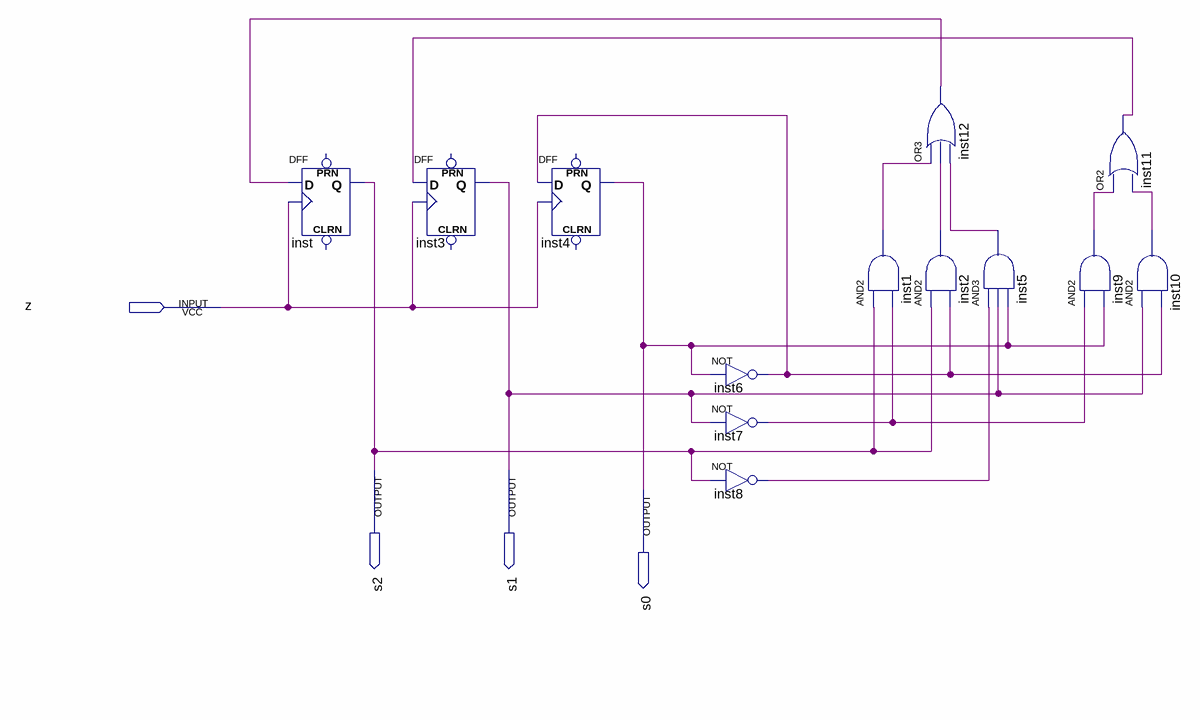
[diagram p0: schematic sheet]
// Quartus schematic Contador.bdf as structural Verilog: 13 symbols, 4 pins
module Contador (
  input  z,
  output s2,
  output s1,
  output s0
);

  wire inst1_out, inst2_out, inst5_out, inst6_out, inst7_out, inst8_out, inst9_out, inst10_out, inst11_out,
       inst12_out;

  DFF inst (.CLK(z), .D(inst12_out), .Q(s2));  // open: CLRN, PRN
  DFF inst3 (.CLK(z), .D(inst11_out), .Q(s1));  // open: CLRN, PRN
  DFF inst4 (.CLK(z), .D(inst6_out), .Q(s0));  // open: CLRN, PRN
  not inst6 (inst6_out, s0);
  not inst7 (inst7_out, s1);
  not inst8 (inst8_out, s2);
  or inst12 (inst12_out, inst1_out, inst2_out, inst5_out);
  and inst1 (inst1_out, s2, inst7_out);
  and inst2 (inst2_out, s2, inst6_out);
  and inst5 (inst5_out, inst8_out, s1, s0);
  and inst9 (inst9_out, inst7_out, s0);
  or inst11 (inst11_out, inst9_out, inst10_out);
  and inst10 (inst10_out, s1, inst6_out);
endmodule
